# Altium schematic sheet Motherboard_schematic.SchDoc
size A3
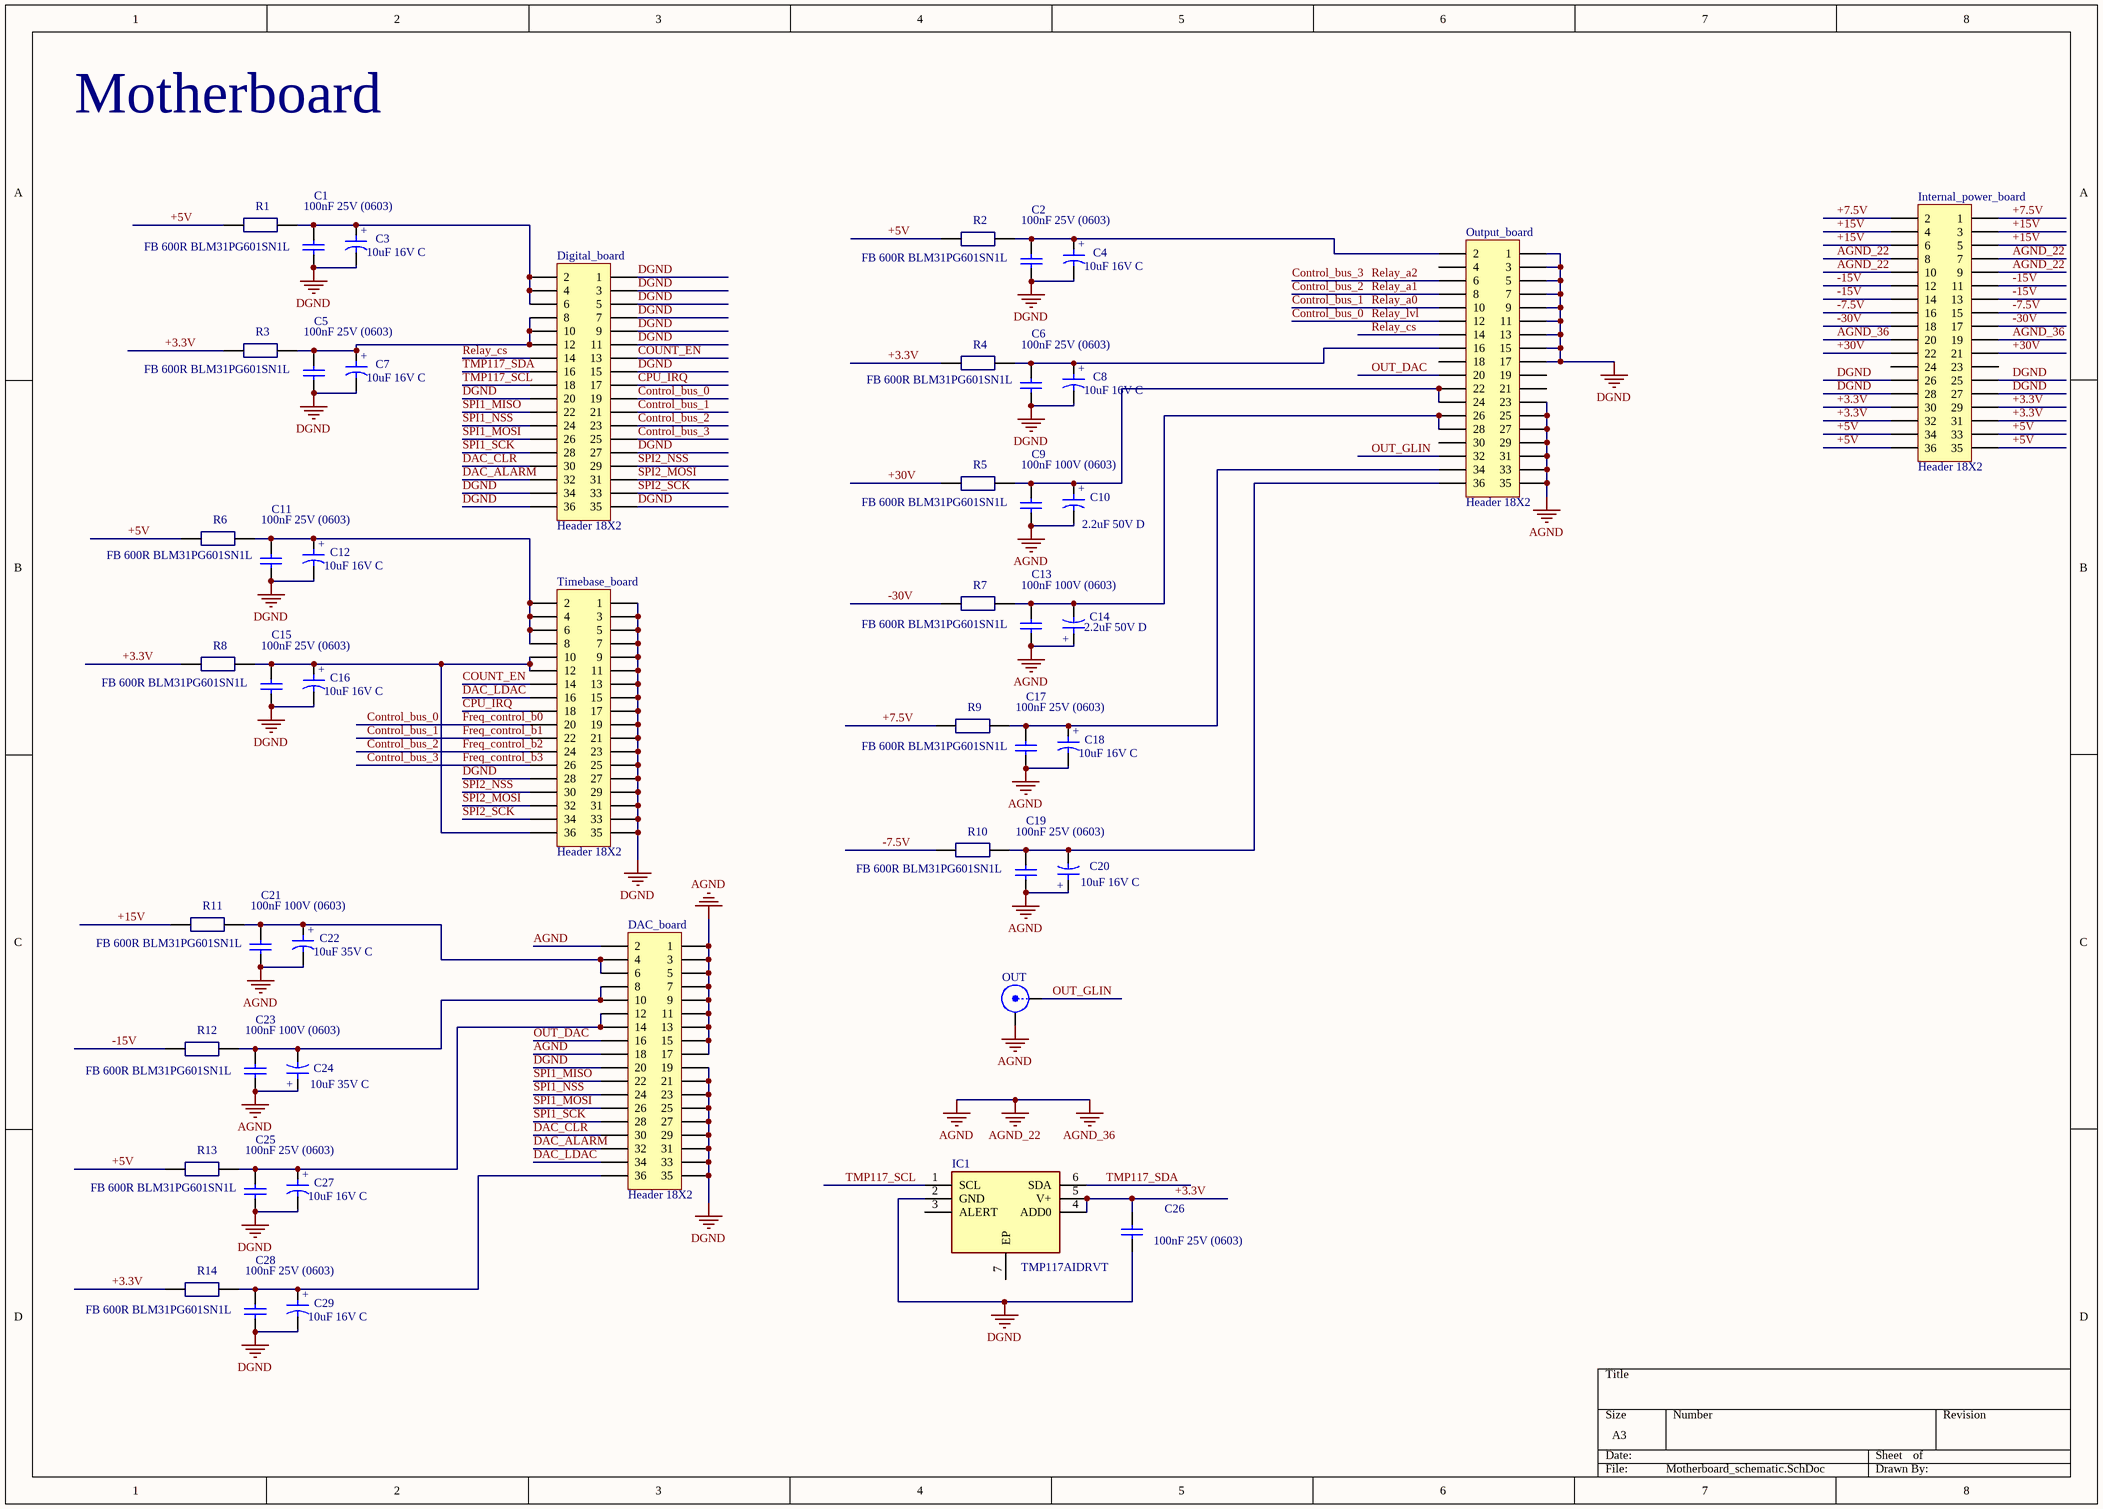
[diagram p0: Motherboard_schematic.SchDoc]

## Parts
C1  100nF 25V (0603)  [CAP 0603]
C2  100nF 25V (0603)  [CAP 0603]
C3  10uF 16V C  [CAPMP6032X280N]
C4  10uF 16V C  [CAPMP6032X280N]
C5  100nF 25V (0603)  [CAP 0603]
C6  100nF 25V (0603)  [CAP 0603]
C7  10uF 16V C  [CAPMP6032X280N]
C8  10uF 16V C  [CAPMP6032X280N]
C9  100nF 100V (0603)  [CAP 0603]
C10  2.2uF 50V D  [CAPMP7343X310N]
C11  100nF 25V (0603)  [CAP 0603]
C12  10uF 16V C  [CAPMP6032X280N]
C13  100nF 100V (0603)  [CAP 0603]
C14  2.2uF 50V D  [CAPMP7343X310N]
C15  100nF 25V (0603)  [CAP 0603]
C16  10uF 16V C  [CAPMP6032X280N]
C17  100nF 25V (0603)  [CAP 0603]
C18  10uF 16V C  [CAPMP6032X280N]
C19  100nF 25V (0603)  [CAP 0603]
C20  10uF 16V C  [CAPMP6032X280N]
C21  100nF 100V (0603)  [CAP 0603]
C22  10uF 35V C  [CAPMP6032X280N]
C23  100nF 100V (0603)  [CAP 0603]
C24  10uF 35V C  [CAPMP6032X280N]
C25  100nF 25V (0603)  [CAP 0603]
C26  100nF 25V (0603)  [CAP 0603]
C27  10uF 16V C  [CAPMP6032X280N]
C28  100nF 25V (0603)  [CAP 0603]
C29  10uF 16V C  [CAPMP6032X280N]
DAC_board  Header 18X2  [HDR2X18]
Digital_board  Header 18X2  [HDR2X18]
IC1  TMP117AIDRVT  [SON65P200X200X80-7N-D]
Internal_power_board  Header 18X2  [HDR2X18]
OUT  SMB  [SMB_V-RJ45]  (value not drawn)
Output_board  Header 18X2  [HDR2X18]
R1  FB 600R BLM31PG601SN1L  [C1206]
R2  FB 600R BLM31PG601SN1L  [C1206]
R3  FB 600R BLM31PG601SN1L  [C1206]
R4  FB 600R BLM31PG601SN1L  [C1206]
R5  FB 600R BLM31PG601SN1L  [C1206]
R6  FB 600R BLM31PG601SN1L  [C1206]
R7  FB 600R BLM31PG601SN1L  [C1206]
R8  FB 600R BLM31PG601SN1L  [C1206]
R9  FB 600R BLM31PG601SN1L  [C1206]
R10  FB 600R BLM31PG601SN1L  [C1206]
R11  FB 600R BLM31PG601SN1L  [C1206]
R12  FB 600R BLM31PG601SN1L  [C1206]
R13  FB 600R BLM31PG601SN1L  [C1206]
R14  FB 600R BLM31PG601SN1L  [C1206]
Timebase_board  Header 18X2  [HDR2X18]

## Nets
AGND: C9.2 C10.2 C13.2 C14.1 C17.2 C18.2 C19.2 C20.1 C21.2 C22.2 C23.2 C24.1 DAC_board.1 DAC_board.2 DAC_board.3 DAC_board.5 DAC_board.7 DAC_board.9 DAC_board.11 DAC_board.13 DAC_board.15 DAC_board.17 DAC_board.18 Internal_power_board.7 Internal_power_board.8 Internal_power_board.9 Internal_power_board.10 Internal_power_board.19 Internal_power_board.20 OUT.2(Y) Output_board.23 Output_board.25 Output_board.27 Output_board.29 Output_board.31 Output_board.33 Output_board.35  [also labelled AGND_22, AGND_36]
DGND: C1.2 C2.2 C3.2 C4.2 C5.2 C6.2 C7.2 C8.2 C11.2 C12.2 C15.2 C16.2 C25.2 C26.2 C27.2 C28.2 C29.2 DAC_board.19 DAC_board.20 DAC_board.21 DAC_board.23 DAC_board.25 DAC_board.27 DAC_board.29 DAC_board.31 DAC_board.33 DAC_board.35 Digital_board.1 Digital_board.3 Digital_board.5 Digital_board.7 Digital_board.9 Digital_board.11 Digital_board.15 Digital_board.20 Digital_board.27 Digital_board.34 Digital_board.35 Digital_board.36 IC1.2(GND) Internal_power_board.25 Internal_power_board.26 Internal_power_board.27 Internal_power_board.28 Output_board.1 Output_board.3 Output_board.5 Output_board.7 Output_board.9 Output_board.11 Output_board.13 Output_board.15 Output_board.17 Timebase_board.1 Timebase_board.3 Timebase_board.5 Timebase_board.7 Timebase_board.9 Timebase_board.11 Timebase_board.13 Timebase_board.15 Timebase_board.17 Timebase_board.19 Timebase_board.21 Timebase_board.23 Timebase_board.25 Timebase_board.27 Timebase_board.28 Timebase_board.29 Timebase_board.31 Timebase_board.33 Timebase_board.35
+3.3V: C26.1 IC1.4(ADD0) IC1.5(V+) Internal_power_board.29 Internal_power_board.30 Internal_power_board.31 Internal_power_board.32 R3.2 R4.2 R8.2 R14.2
+5V: Internal_power_board.33 Internal_power_board.34 Internal_power_board.35 Internal_power_board.36 R1.2 R2.2 R6.2 R13.2
+7.5V: Internal_power_board.1 Internal_power_board.2 R9.2
+15V: Internal_power_board.3 Internal_power_board.4 Internal_power_board.5 Internal_power_board.6 R11.2
+30V: Internal_power_board.21 Internal_power_board.22 R5.2
-7.5V: Internal_power_board.15 Internal_power_board.16 R10.2
-15V: Internal_power_board.11 Internal_power_board.12 Internal_power_board.13 Internal_power_board.14 R12.2
-30V: Internal_power_board.17 Internal_power_board.18 R7.2
Control_bus_0: Digital_board.19 Output_board.12 Timebase_board.20  [also labelled Freq_control_b0, Relay_lvl]
Control_bus_1: Digital_board.21 Output_board.10 Timebase_board.22  [also labelled Freq_control_b1, Relay_a0]
Control_bus_2: Digital_board.23 Output_board.8 Timebase_board.24  [also labelled Freq_control_b2, Relay_a1]
Control_bus_3: Digital_board.25 Output_board.6 Timebase_board.26  [also labelled Freq_control_b3, Relay_a2]
COUNT_EN: Digital_board.13 Timebase_board.14
CPU_IRQ: Digital_board.17 Timebase_board.18
DAC_ALARM: DAC_board.32 Digital_board.32
DAC_CLR: DAC_board.30 Digital_board.30
DAC_LDAC: DAC_board.34 Timebase_board.16
OUT_DAC: DAC_board.16 Output_board.20
OUT_GLIN: OUT.1(X) Output_board.32
Relay_cs: Digital_board.14 Output_board.14
SPI1_MISO: DAC_board.22 Digital_board.22
SPI1_MOSI: DAC_board.26 Digital_board.26
SPI1_NSS: DAC_board.24 Digital_board.24
SPI1_SCK: DAC_board.28 Digital_board.28
SPI2_MOSI: Digital_board.31 Timebase_board.32
SPI2_NSS: Digital_board.29 Timebase_board.30
SPI2_SCK: Digital_board.33 Timebase_board.34
TMP117_SCL: Digital_board.18 IC1.1(SCL)
TMP117_SDA: Digital_board.16 IC1.6(SDA)
NetC1_1: C1.1 C3.1 Digital_board.2 Digital_board.4 Digital_board.6 R1.1(A)
NetC2_1: C2.1 C4.1 Output_board.2 R2.1(A)
NetC5_1: C5.1 C7.1 Digital_board.8 Digital_board.10 Digital_board.12 R3.1(A)
NetC6_1: C6.1 C8.1 Output_board.16 R4.1(A)
NetC9_1: C9.1 C10.1 Output_board.22 Output_board.24 R5.1(A)
NetC11_1: C11.1 C12.1 R6.1(A) Timebase_board.2 Timebase_board.4 Timebase_board.6 Timebase_board.8
NetC13_1: C13.1 C14.2 Output_board.26 Output_board.28 R7.1(A)
NetC15_1: C15.1 C16.1 R8.1(A) Timebase_board.10 Timebase_board.12 Timebase_board.36
NetC17_1: C17.1 C18.1 Output_board.34 R9.1(A)
NetC19_1: C19.1 C20.2 Output_board.36 R10.1(A)
NetC21_1: C21.1 C22.1 DAC_board.4 DAC_board.6 R11.1(A)
NetC23_1: C23.1 C24.2 DAC_board.8 DAC_board.10 R12.1(A)
NetC25_1: C25.1 C27.1 DAC_board.12 DAC_board.14 R13.1(A)
NetC28_1: C28.1 C29.1 DAC_board.36 R14.1(A)

Not connected (* = marked no-connect by the designer): IC1 3(ALERT) 7(EP); Internal_power_board 23 24; Output_board 4 18 19 21 30

## Notes on the sheet
- Motherboard
- (in symbol CTE6032-28_10UF_25V_10%_LESR0500) +
- (in symbol CTE7343-31_22UF_35V_20%_LESR0400) +

## Library data of the parts
C1 C2 C5 C6 C9 C11 C13 C15 C17 C19 C21 C23 C25 C26 C28 = Cap Semi: Capacitor (Semiconductor SIM Model); Order: CC0603KRX7R8BB104; Published: 8-Jun-2000; LatestRevisionDate: 29-May-2009; LatestRevisionNote: IPC-7351 Footprint Added.; PackageReference: C1206; Publisher: Altium Limited; PackageDescription: Chip Capacitor
  C1 C2 C5 C6 C11 C15 C17 C19 C25 C26 C28: Value: 100nF 25V (0603)
  C9 C13 C21 C23: Value: 100nF 100V (0603)
C3 C4 C7 C8 C12 C16 C18 C20 C22 C24 C27 C29 = CTE6032-28_10UF_25V_10%_LESR0500: Polarised capacitor; Part Description: Low ESR 0R5 Solid Tantalum Chip Capacitor; Manufacturer: GENERIC; Manufacturer1 Part Number: TPSC106K025R0500; Voltage: 25V; Tolerance: ±10%; Part Number: CTE6032-28_10UF_25V_10%_LESR0500; Component Kind: Standard; Component Type: Standard; Pin Count: 2; Status: Preferred; Manufacturer Part Number: CTE6032-28_10UF_25V_10%_LESR0500; Case: C; Mounted: Yes; Socket: No; SMD: Yes; Sense: No; Manufacturer1 Example: AVX; Manufacturer1 ComponentHeight: 2.8mm; HelpURL: \\cern.ch\dfs\Applications\Altium\Datasheets\CTE-LESR_AVX_TPS.pdf; Author: CERN DEM JLC; CreateDate: 05.05.2008; LatestRevisionDate: 20.01.2009
  C3 C4 C7 C8 C12 C16 C18 C20 C27 C29: Value: 10uF 16V C
  C22 C24: Value: 10uF 35V C
C10 C14 = CTE7343-31_22UF_35V_20%_LESR0400: Polarised capacitor; Part Description: Low ESR 0R4 Solid Tantalum Chip Capacitor; Manufacturer: GENERIC; Manufacturer1 Part Number: TPSD226M035R0400; Voltage: 35V; Tolerance: ±20%; Part Number: CTE7343-31_22UF_35V_20%_LESR0400; Component Kind: Standard; Component Type: Standard; Pin Count: 2; Value: 2.2uF 50V D; Status: None; Manufacturer Part Number: CTE7343-31_22UF_35V_20%_LESR0400; Case: D; Mounted: Yes; Socket: No; SMD: Yes; Sense: No; Manufacturer1 Example: AVX; Manufacturer1 ComponentHeight: 3.1mm; HelpURL: \\cern.ch\dfs\Applications\Altium\Datasheets\CTE-LESR_AVX_TPS.pdf; Author: CERN DEM MR; CreateDate: 19.05.2016; LatestRevisionDate: 19.05.2016
DAC_board Digital_board Internal_power_board Output_board Timebase_board = Header 18X2: Header, 18-Pin, Dual row; System: Connector; LatestRevisionDate: 17-Jul-2002; LatestRevisionNote: Re-released for DXP Platform.; Publisher: Altium Limited
IC1 = TMP117AIDRVT: Integrated Circuit; Manufacturer_Name: Texas Instruments; Datasheet Link: https://www.arrow.com/en/products/tmp117aidrvt/texas-instruments; Height: 0.8mm; Manufacturer_Part_Number: TMP117AIDRVT; Mouser Part Number: 595-TMP117AIDRVT; Mouser Price/Stock: https://www.mouser.co.uk/ProductDetail/Texas-Instruments/TMP117AIDRVT?qs=qSfuJ%252Bfl%2Fd7VBuV3yl1aHg%3D%3D; Arrow Part Number: TMP117AIDRVT; Arrow Price/Stock: https://www.arrow.com/en/products/tmp117aidrvt/texas-instruments?region=nac
OUT = SMB: SMB Straight Connector; LatestRevisionDate: 17-Jul-2002; LatestRevisionNote: Re-released for DXP Platform.; Publisher: Altium Limited
R1-R14 = Resistor 0805: Order: CR0603-JW-220GLF; Avail: 20; Value: FB 600R BLM31PG601SN1L